# EAGLE schematic Teensy_setup (EAGLE 9.3.1)
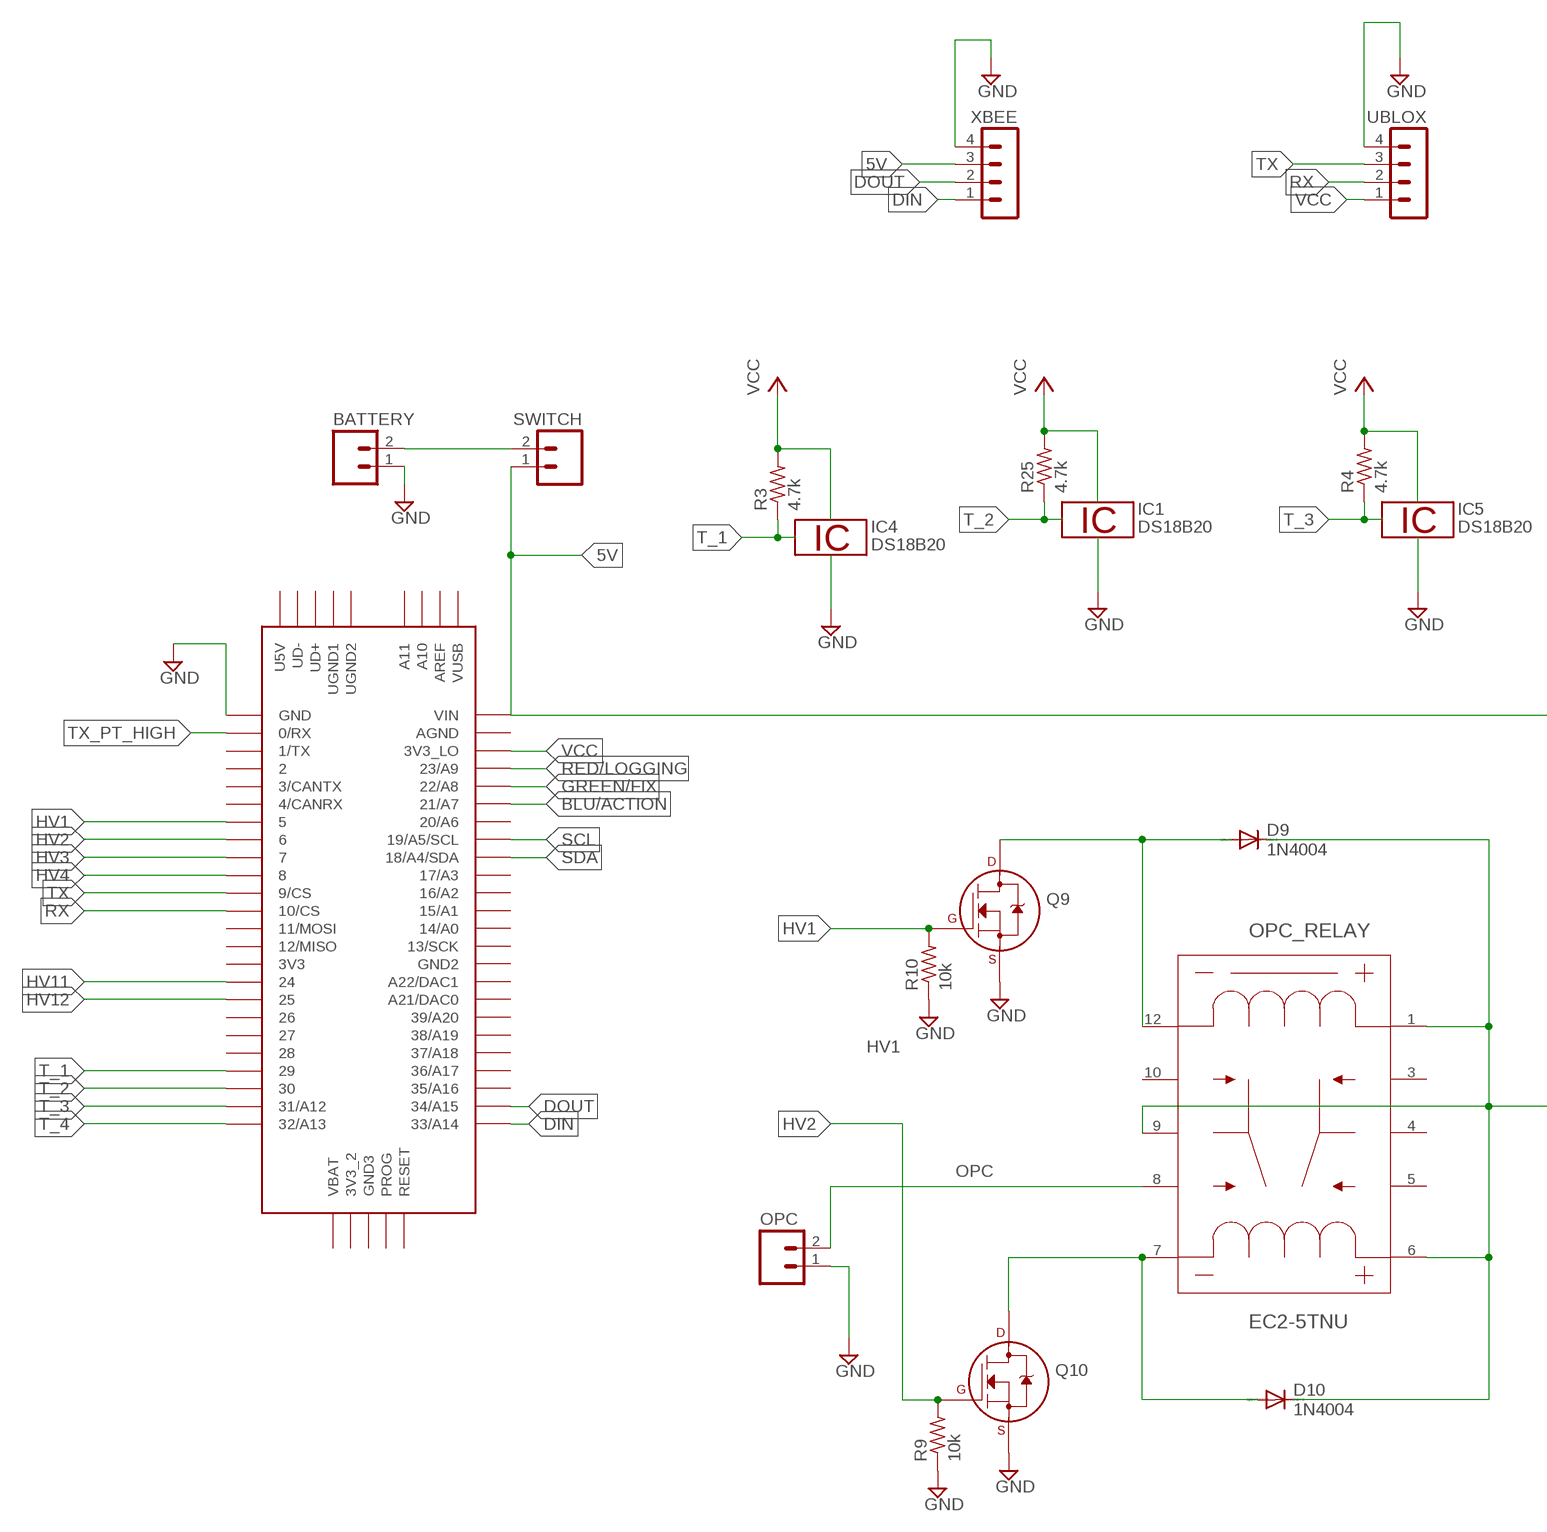
[diagram p0: schematic, sheet 1, part 1 of 2]
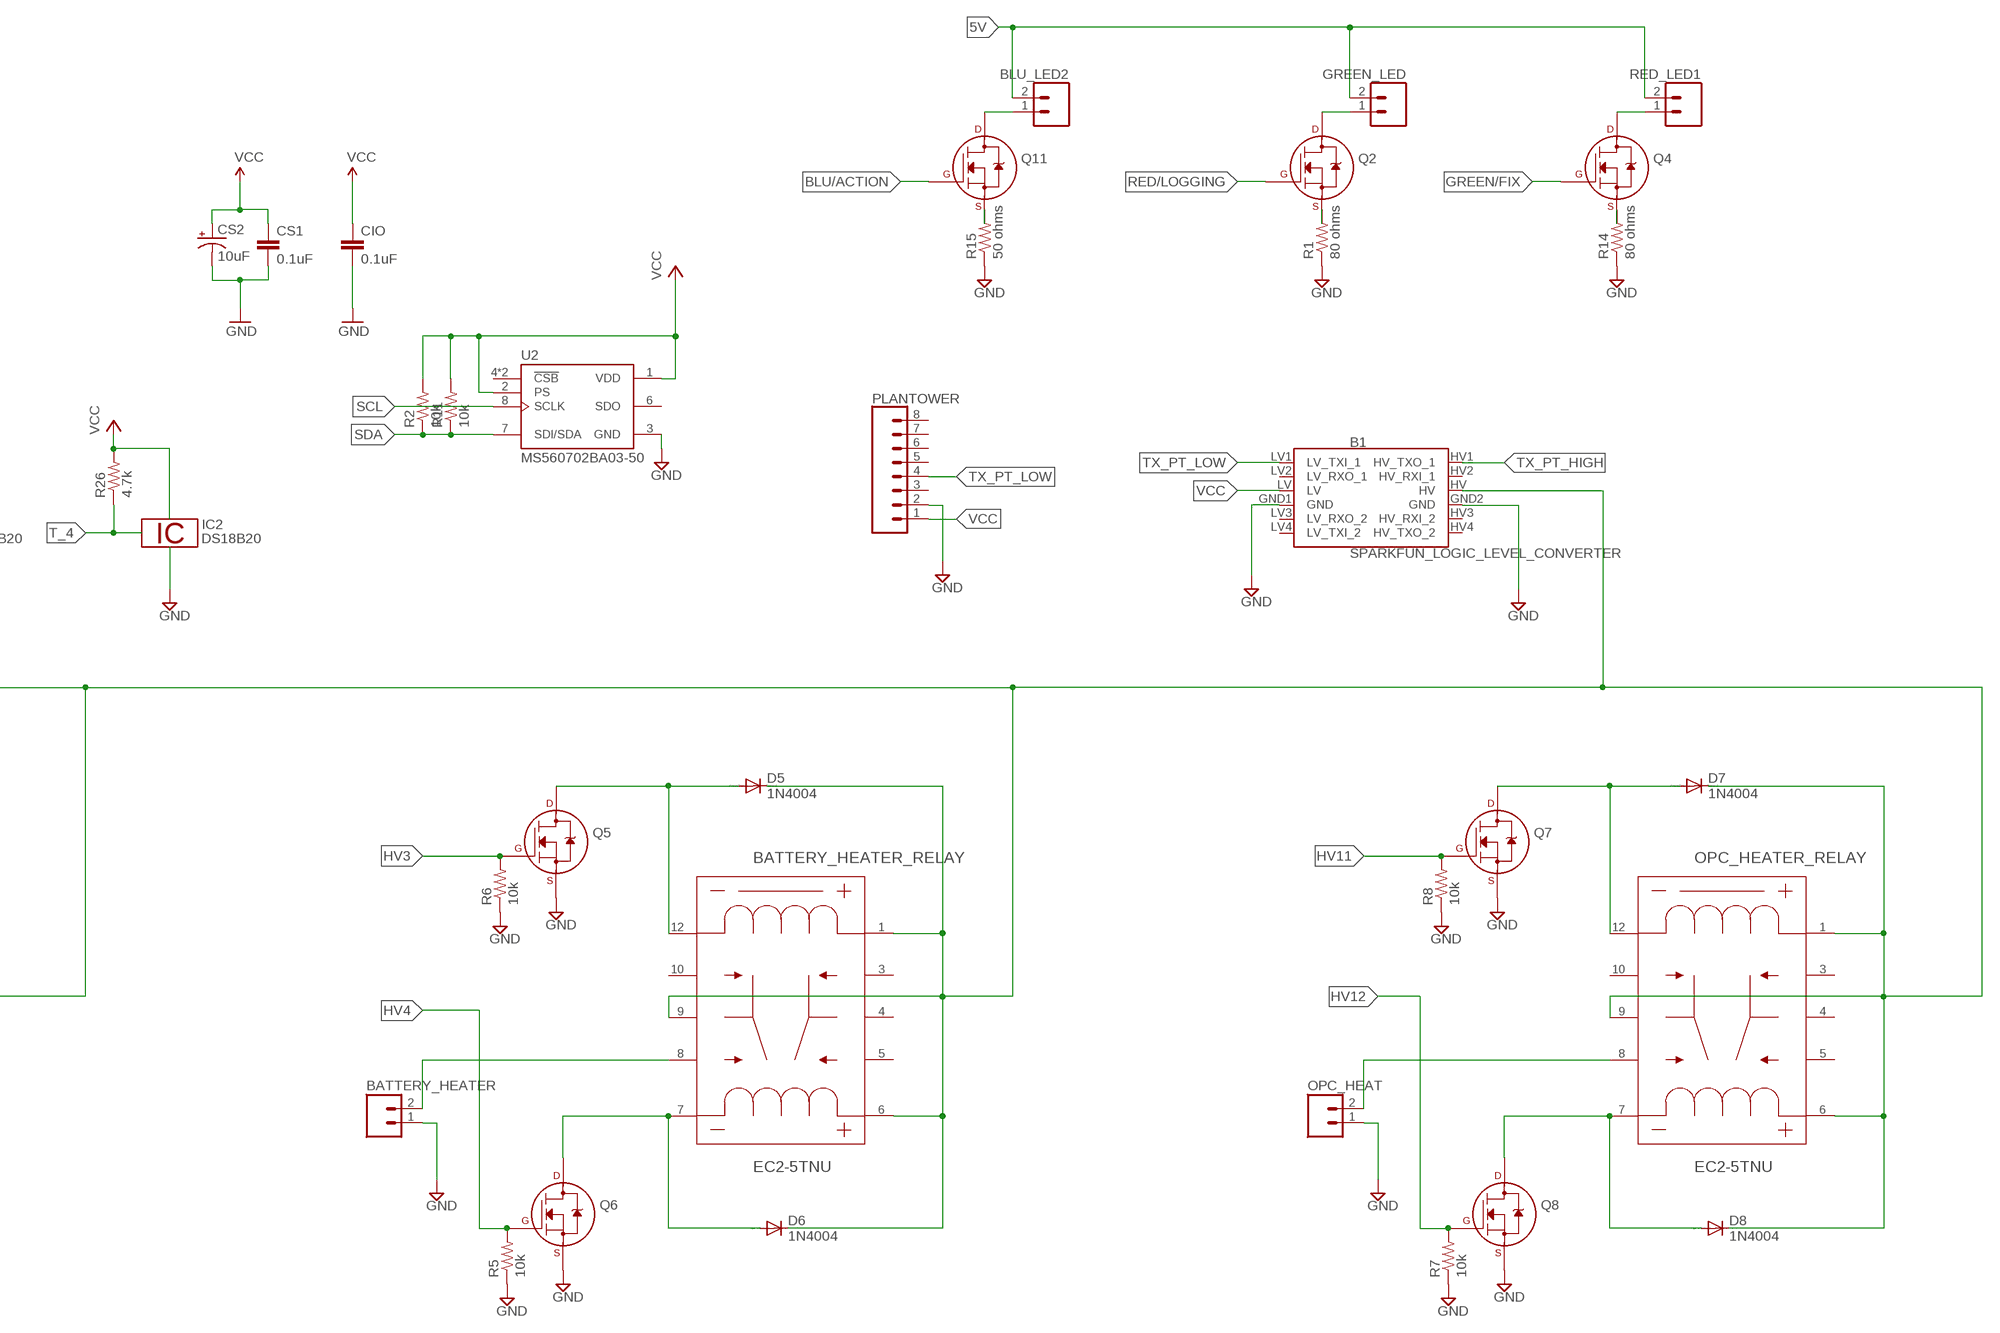
[diagram p1: schematic, sheet 1, part 2 of 2]

## Parts
B1  SPARKFUN_LOGIC_LEVEL_CONVERTER  [SPARKFUN_LOGIC_LEVEL_CONVERTER]
BATTERY  M02  [02P]
BATTERY_HEATER  M02  [02P]
BATTERY_HEATER_RELAY  EC2-5TNU  [EC2TNU]
BLU_LED2  M02  [02P]
CIO  0.1uF  CAP0402-CAP  [0402-CAP]
CS1  0.1uF  CAP0402-CAP  [0402-CAP]
CS2  10uF  CAP_POL1206  [EIA3216]
D5  1N4004  [DO41-10]
D6  1N4004  [DO41-10]
D7  1N4004  [DO41-10]
D8  1N4004  [DO41-10]
D9  1N4004  [DO41-10]
D10  1N4004  [DO41-10]
GREEN_LED  M02  [02P]
IC1  DS18B20  [TO92-]
IC2  DS18B20  [TO92-]
IC4  DS18B20  [TO92-]
IC5  DS18B20  [TO92-]
OPC  M02  [02P]
OPC_HEAT  M02  [02P]
OPC_HEATER_RELAY  EC2-5TNU  [EC2TNU]
OPC_RELAY  EC2-5TNU  [EC2TNU]
PLANTOWER  CONN_08"  [1X08]
Q2  2N7000_TO92  [TO-92]
Q4  2N7000_TO92  [TO-92]
Q5  2N7000_TO92  [TO-92]
Q6  2N7000_TO92  [TO-92]
Q7  2N7000_TO92  [TO-92]
Q8  2N7000_TO92  [TO-92]
Q9  2N7000_TO92  [TO-92]
Q10  2N7000_TO92  [TO-92]
Q11  2N7000_TO92  [TO-92]
R1  80 ohms  R-US_0207/7  [0207/7]
R2  10k  R-US_0204/7  [0204/7]
R3  4.7k  R-US_0204/7  [0204/7]
R4  4.7k  R-US_0204/7  [0204/7]
R5  10k  R-US_0207/7  [0207/7]
R6  10k  R-US_0207/7  [0207/7]
R7  10k  R-US_0207/7  [0207/7]
R8  10k  R-US_0207/7  [0207/7]
R9  10k  R-US_0207/7  [0207/7]
R10  10k  R-US_0207/7  [0207/7]
R11  10k  R-US_0204/7  [0204/7]
R14  80 ohms  R-US_0207/7  [0207/7]
R15  50 ohms  R-US_0207/7  [0207/7]
R25  4.7k  R-US_0204/7  [0204/7]
R26  4.7k  R-US_0204/7  [0204/7]
RED_LED1  M02  [02P]
SWITCH  M02  [02P]
U2  MS560702BA03-50  [SON125P300X500X100-8N]
U$1  TEENSY_3.5/3.6  [TEENSY_3.5/3.6]
UBLOX  MA04-1  [MA04-1]
XBEE  MA04-1  [MA04-1]

## Nets
5V [5V_Relay]: BLU_LED2.2 GREEN_LED.2 RED_LED1.2 SWITCH.1 U$1.VIN XBEE.3
5V2 [5V_Relay]: B1.HV BATTERY_HEATER_RELAY.1 BATTERY_HEATER_RELAY.6 BATTERY_HEATER_RELAY.9 D5.C D6.C D7.C D8.C D9.C D10.C OPC_HEATER_RELAY.1 OPC_HEATER_RELAY.6 OPC_HEATER_RELAY.9 OPC_RELAY.1 OPC_RELAY.6 OPC_RELAY.9
BATTERY_HEATER [5V_Relay]: OPC_HEAT.2 OPC_HEATER_RELAY.8
BLU/ACTION: Q11.2(G) U$1.21/A7
DIN: U$1.33/A14 XBEE.1
DOUT: U$1.34/A15 XBEE.2
GND [5V_Relay]: B1.GND1(GND) B1.GND2(GND) BATTERY.1 BATTERY_HEATER.1 CIO.2 CS1.2 CS2.C(-) OPC.1 OPC_HEAT.1 PLANTOWER.2 Q5.1(S) Q6.1(S) Q7.1(S) Q8.1(S) Q9.1(S) Q10.1(S) R1.1 R5.1 R6.1 R7.1 R8.1 R9.1 R10.1 R14.1 R15.1 U2.3(GND) U$1.GND UBLOX.4 XBEE.4
GREEN/FIX: Q4.2(G) U$1.22/A8
HV1: Q9.2(G) R10.2 U$1.5
HV2: Q10.2(G) R9.2 U$1.6
HV3: Q5.2(G) R6.2 U$1.7
HV4: Q6.2(G) R5.2 U$1.8
HV11: Q7.2(G) R8.2 U$1.24
HV12: Q8.2(G) R7.2 U$1.25
N$1: BATTERY.2 SWITCH.2
N$4: Q2.1(S) R1.2
N$5: GREEN_LED.1 Q2.3(D)
N$6: Q4.1(S) R14.2
N$8 [5V_Relay]: BATTERY_HEATER_RELAY.12 D5.A Q5.3(D)
N$9 [5V_Relay]: BATTERY_HEATER_RELAY.7 D6.A Q6.3(D)
N$10 [5V_Relay]: D7.A OPC_HEATER_RELAY.12 Q7.3(D)
N$11 [5V_Relay]: D8.A OPC_HEATER_RELAY.7 Q8.3(D)
N$12 [5V_Relay]: D9.A OPC_RELAY.12 Q9.3(D)
N$13 [5V_Relay]: D10.A OPC_RELAY.7 Q10.3(D)
N$16: Q4.3(D) RED_LED1.1
N$17: Q11.1(S) R15.2
N$18: BLU_LED2.1 Q11.3(D)
OPC [5V_Relay]: BATTERY_HEATER.2 BATTERY_HEATER_RELAY.8 OPC.2 OPC_RELAY.8
RED/LOGGING: Q2.2(G) U$1.23/A9
RX: U$1.10/CS UBLOX.2
SCL: U2.8(SCLK) U$1.19/A5/SCL
SDA: R2.1 R11.1 U2.7(SDI/SDA) U$1.18/A4/SDA
T_1: R3.1 U$1.29
T_2: R25.1 U$1.30
T_3: R4.1 U$1.31/A12
T_4: R26.1 U$1.32/A13
TX: U$1.9/CS UBLOX.3
TX_PT_HIGH: B1.HV1(HV_TXO_1) U$1.0/RX
TX_PT_LOW: B1.LV1(LV_TXI_1) PLANTOWER.4
VCC: B1.LV CIO.1 CS1.1 CS2.A(+) PLANTOWER.1 R2.2 R3.2 R4.2 R11.2 R25.2 R26.2 U2.1(VDD) U2.2(PS) U$1.3V3_LO UBLOX.1
Unconnected: B1.HV2(HV_RXI_1) B1.HV3(HV_RXI_2) B1.HV4(HV_TXO_2) B1.LV2(LV_RXO_1) B1.LV3(LV_RXO_2) B1.LV4(LV_TXI_2) BATTERY_HEATER_RELAY.3 BATTERY_HEATER_RELAY.4 BATTERY_HEATER_RELAY.5 BATTERY_HEATER_RELAY.10 OPC_HEATER_RELAY.3 OPC_HEATER_RELAY.4 OPC_HEATER_RELAY.5 OPC_HEATER_RELAY.10 OPC_RELAY.3 OPC_RELAY.4 OPC_RELAY.5 OPC_RELAY.10 PLANTOWER.3 PLANTOWER.5 PLANTOWER.6 PLANTOWER.7 PLANTOWER.8 U2.4(!CSB) U2.5(!CSB) U2.6(SDO) U$1.1/TX U$1.2 U$1.3/CANTX U$1.3V3 U$1.3V3_2 U$1.4/CANRX U$1.11/MOSI U$1.12/MISO U$1.13/SCK U$1.14/A0 U$1.15/A1 U$1.16/A2 U$1.17/A3 U$1.20/A6 U$1.21/DAC0(A21/DAC0) U$1.26 U$1.27 U$1.28 U$1.35/A16 U$1.36/A17 U$1.37/A18 U$1.38/A19 U$1.39/A20 U$1.A10 U$1.A11 U$1.A22/DAC1 U$1.AGND U$1.AREF U$1.GND2 U$1.GND3 U$1.PROG U$1.RESET U$1.U5V U$1.UD+ U$1.UD- U$1.UGND1 U$1.UGND2 U$1.VBAT U$1.VUSB

## Power pins joined to a net without a drawn wire
1W: IC1.2 IC2.2 IC4.2 IC5.2
GND: IC1.1 IC2.1 IC4.1 IC5.1
VDD: IC1.3 IC2.3 IC4.3 IC5.3

## Library data of the parts
B1 = SparkFun-Boards:SPARKFUN_LOGIC_LEVEL_CONVERTER: SparkFun Logic Level Converter -Bi-Directional This is the mechnical outline for the 3.3V - 5V bi directional logic level converter. *Note, the "LOCK" Package has the header pins staggered by an offset of 5 mils (off center line), so that when you slide a row of standard 0.1" headers into the PTH pads, it will hold position vertically. See the follwing turorial for more information on this type of special footprints: Sneaky Footprints <https://www.sparkfun.com/tutorials/114> SparkFun Products: SparkFun Logic Level Converter - Bi-Directional <https://www.sparkfun.com/products/12009>
BATTERY BATTERY_HEATER BLU_LED2 GREEN_LED OPC OPC_HEAT RED_LED1 SWITCH = con-amp-quick:M02: AMP QUICK CONNECTOR; OC_FARNELL: unknown; OC_NEWARK: unknown
BATTERY_HEATER_RELAY OPC_HEATER_RELAY OPC_RELAY = EC2-5TNU:EC2-5TNU; MANUFACTURER_PART_NUMBER: EC25TNU; VENDOR: KEMET
CIO CS1 = SparkFun:CAP: Capacitor Standard 0603 ceramic capacitor, and 0.1" leaded capacitor.
CS2 = SparkFun:CAP_POL: Capacitor Polarized These are standard SMD and PTH capacitors. Normally 10uF, 47uF, and 100uF in electrolytic and tantalum varieties. Always verify the external diameter of the through hole cap, it varies with capacity, voltage, and manufacturer. The EIA devices should be standard.
D5-D10 = diode:1N4004: DIODE general purpose rectifier, 1 A
IC1 IC2 IC4 IC5 = 1wire:DS18B20: Programmable Resolution Digital Thermometer This chip provides a onewire thermosensor with approx. 0.5°C accuracy. A programmable over/undertemperure alarm is available. The precision can be set from 9..12 bits. Notes: Vdd must be applied for accurate measurements at low temperatures, as the parasite power circuit otherwise heats the sensor. If parasite power is used, Vdd has to be connected to GND. The DS1822 is a low-cost thermometer chip, the DS18S20 is similar to the DS18B20, but with 9 Bit precision only. Author: Jan Kandziora <jjj@gmx.de>
PLANTOWER = SparkFun-Connectors:CONN_08: Multi connection point. Often used as Generic Header-pin footprint for 0.1 inch spaced/style header connections On any of the 0.1 inch spaced packages, you can populate with these: Break Away Headers - Straight <https://www.sparkfun.com/products/116> (PRT-00116) Break Away Male Headers - Right Angle <https://www.sparkfun.com/products/553> (PRT-00553) Female Headers <https://www.sparkfun.com/products/115> (PRT-00115) Break Away Headers - Machine Pin <https://www.sparkfun.com/products/117> (PRT-00117) Break Away Female Headers - Swiss Machine Pin <https://www.sparkfun.com/products/743> (PRT-00743) Arduino Stackable Header - 8 Pin <https://www.sparkfun.com/products/9279> (PRT-09279) For SCREWTERMINALS and SPRING TERMINALS visit here: Screw Terimnals on SparkFun.com <https://www.sparkfun.com/search/results?term=Screw+Terminals> (5mm/3.5mm/2.54mm spacing) This device is also useful as a general connection point to wire up your design to another part of your project. Our various solder wires solder well into these plated through hole pads. Hook-Up Wire - Assortment (Stranded, 22 AWG) <https://www.sparkfun.com/products/11375> (PRT-11375) Hook-Up Wire - Assortment (Solid Core, 22 AWG) <https://www.sparkfun.com/products/11367> (PRT-11367) View the entire wire category on our website here <https://www.sparkfun.com/categories/141> Special notes: Molex polarized connector foot print use with SKU : PRT-08231 with associated crimp pins and housings. 1MM SMD Version SKU: PRT-10208 NOTES ON THE VARIANTS LOCK and LOCK_LONGPADS... This footprint was designed to help hold the alignment of a through-hole component (i.e. 6-pin header) while soldering it into place. You may notice that each hole has been shifted either up or down by 0.005 of an inch from it's more standard position (which is a perfectly straight line). This slight alteration caused the pins (the squares in the middle) to touch the edges of the holes. Because they are alternating, it causes a "brace" to hold the component in place. 0.005 has proven to be the perfect amount of "off-center" position when using our standard breakaway headers. Although looks a little odd when you look at the bare footprint, once you have a header in there, the alteration is very hard to notice. Also,if you push a header all the way into place, it is covered up entirely on the bottom side.; PROD_ID: CONN-08438
Q2 Q4-Q11 = transistors:2N700*: 2N7000, 2N7002, NDS7002A N-channel enhancement mode MOSFET
R1 R3 R4 R14 R15 R25 R26 = resistor:R-US_: RESISTOR, American symbol
R2 R5-R11 = rcl:R-US_: RESISTOR, American symbol; SPICEPREFIX: R
U2 = MS560702BA03-50:MS560702BA03-50: BAROMETRIC PRESSURE SENSOR; COMMENT: MS560702BA03-50; DESCRIPTION: MS5607-02BA03 Series 3 V 1 to 120 kPa Absolute Barometric Pressure Sensor; DIGI-KEY_PART_NUMBER: 223-1198-1-ND; DIGI-KEY_PURCHASE_URL: https://www.digikey.com/product-detail/en/te-connectivity-measurement-specialties/MS560702BA03-50/223-1198-1-ND/4700921?utm_source=snapeda&utm_medium=aggregator&utm_campaign=symbol; EU_ROHS_COMPLIANCE: Compliant; MF: TE Connectivity; MP: MS560702BA03-50; PACKAGE: SMD-8 TE Connectivity; TE_PURCHASE_URL: https://www.te.com/usa-en/product-MS560702BA03-50.html?te_bu=Cor&te_type=disp&te_campaign=seda_glo_cor-seda-global-disp-prtnr-fy19-seda-model-bom-cta_sma-317_1&elqCampaignId=32493
U$1 = Teensy356:TEENSY_3.5/3.6
UBLOX XBEE = con-lstb:MA04-1: PIN HEADER; OC_FARNELL: unknown; OC_NEWARK: unknown

## Net classes
1 5V_Relay: width 0.254 mm, drill 0.889 mm, clearance 0.127 mm